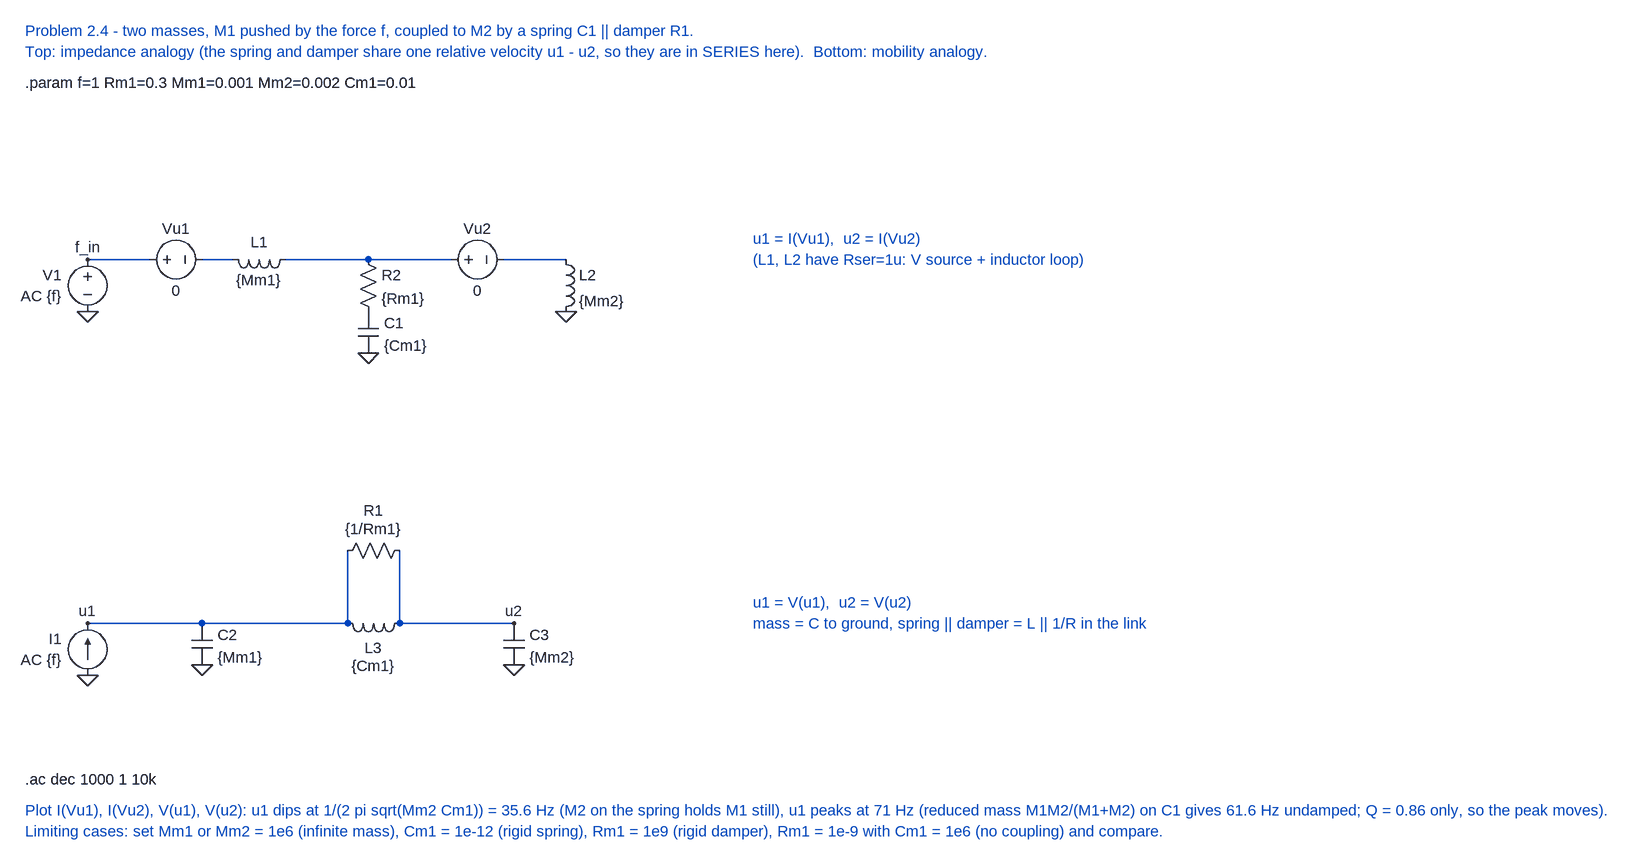
[diagram p0: schematic P2_4_Two_Mass.asc]
P2_4_Two_Mass.asc, the LTspice schematic file:
Version 4
SHEET 1 3000 1600
WIRE 0 0 96 0
WIRE 176 0 224 0
WIRE 304 0 560 0
WIRE 640 0 736 0
WIRE 0 560 400 560
WIRE 400 560 400 448
WIRE 480 560 480 448
WIRE 480 560 656 560
FLAG 0 80 0
FLAG 0 0 f_in
FLAG 432 144 0
FLAG 736 80 0
FLAG 0 640 0
FLAG 0 560 u1
FLAG 176 624 0
FLAG 656 560 u2
FLAG 656 624 0
SYMBOL voltage 0 -16 R0
WINDOW 0 -40 40 Right 2
WINDOW 3 -40 72 Right 2
SYMATTR InstName V1
SYMATTR Value AC {f}
SYMBOL voltage 80 0 R270
WINDOW 0 32 56 VTop 2
WINDOW 3 -32 56 VBottom 2
SYMATTR InstName Vu1
SYMATTR Value 0
SYMBOL ind 320 -16 R90
WINDOW 0 5 56 VBottom 2
WINDOW 3 32 56 VTop 2
SYMATTR InstName L1
SYMATTR Value {Mm1}
SYMATTR SpiceLine Rser=1u
SYMBOL res 416 -16 R0
SYMATTR InstName R2
SYMATTR Value {Rm1}
SYMBOL cap 416 80 R0
WINDOW 0 40 18 Left 2
WINDOW 3 40 52 Left 2
SYMATTR InstName C1
SYMATTR Value {Cm1}
SYMBOL voltage 544 0 R270
WINDOW 0 32 56 VTop 2
WINDOW 3 -32 56 VBottom 2
SYMATTR InstName Vu2
SYMATTR Value 0
SYMBOL ind 720 -16 R0
SYMATTR InstName L2
SYMATTR Value {Mm2}
SYMATTR SpiceLine Rser=1u
SYMBOL current 0 640 R180
WINDOW 0 40 56 Left 2
WINDOW 3 40 24 Left 2
SYMATTR InstName I1
SYMATTR Value AC {f}
SYMBOL cap 160 560 R0
WINDOW 0 40 18 Left 2
WINDOW 3 40 52 Left 2
SYMATTR InstName C2
SYMATTR Value {Mm1}
SYMBOL ind 496 544 R90
WINDOW 0 38 56 VTop 2
WINDOW 3 66 56 VTop 2
SYMATTR InstName L3
SYMATTR Value {Cm1}
SYMATTR SpiceLine Rser=1u
SYMBOL res 496 432 R90
WINDOW 0 -30 56 VBottom 2
WINDOW 3 -2 56 VBottom 2
SYMATTR InstName R1
SYMATTR Value {1/Rm1}
SYMBOL cap 640 560 R0
WINDOW 0 40 18 Left 2
WINDOW 3 40 52 Left 2
SYMATTR InstName C3
SYMATTR Value {Mm2}
TEXT -96 -352 Left 2 ;Problem 2.4 - two masses, M1 pushed by the force f, coupled to M2 by a spring C1 || damper R1.
TEXT -96 -320 Left 2 ;Top: impedance analogy (the spring and damper share one relative velocity u1 - u2, so they are in SERIES here).  Bottom: mobility analogy.
TEXT -96 -272 Left 2 !.param f=1 Rm1=0.3 Mm1=0.001 Mm2=0.002 Cm1=0.01
TEXT 1024 -32 Left 2 ;u1 = I(Vu1),  u2 = I(Vu2)
TEXT 1024 0 Left 2 ;(L1, L2 have Rser=1u: V source + inductor loop)
TEXT 1024 528 Left 2 ;u1 = V(u1),  u2 = V(u2)
TEXT 1024 560 Left 2 ;mass = C to ground, spring || damper = L || 1/R in the link
TEXT -96 800 Left 2 !.ac dec 1000 1 10k
TEXT -96 848 Left 2 ;Plot I(Vu1), I(Vu2), V(u1), V(u2): u1 dips at 1/(2 pi sqrt(Mm2 Cm1)) = 35.6 Hz (M2 on the spring holds M1 still), u1 peaks at 71 Hz (reduced mass M1M2/(M1+M2) on C1 gives 61.6 Hz undamped; Q = 0.86 only, so the peak moves).
TEXT -96 880 Left 2 ;Limiting cases: set Mm1 or Mm2 = 1e6 (infinite mass), Cm1 = 1e-12 (rigid spring), Rm1 = 1e9 (rigid damper), Rm1 = 1e-9 with Cm1 = 1e6 (no coupling) and compare.

The netlist it stands for:
* P2_4_Two_Mass.asc
V1 f_in 0 AC {f}
Vu1 f_in N001 0
L1 N002 N001 {Mm1} Rser=1u
R2 N002 P001 {Rm1}
C1 P001 0 {Cm1}
Vu2 N002 N003 0
L2 N003 0 {Mm2} Rser=1u
I1 0 u1 AC {f}
C2 u1 0 {Mm1}
L3 u2 u1 {Cm1} Rser=1u
R1 u2 u1 {1/Rm1}
C3 u2 0 {Mm2}
* Problem 2.4 - two masses, M1 pushed by the force f, coupled to M2 by a spring C1 || damper R1.
* Top: impedance analogy (the spring and damper share one relative velocity u1 - u2, so they are in SERIES here).  Bottom: mobility analogy.
.param f=1 Rm1=0.3 Mm1=0.001 Mm2=0.002 Cm1=0.01
* u1 = I(Vu1),  u2 = I(Vu2)
* (L1, L2 have Rser=1u: V source + inductor loop)
* u1 = V(u1),  u2 = V(u2)
* mass = C to ground, spring || damper = L || 1/R in the link
.ac dec 1000 1 10k
* Plot I(Vu1), I(Vu2), V(u1), V(u2): u1 dips at 1/(2 pi sqrt(Mm2 Cm1)) = 35.6 Hz (M2 on the spring holds M1 still), u1 peaks at 71 Hz (reduced mass M1M2/(M1+M2) on C1 gives 61.6 Hz undamped; Q = 0.86 only, so the peak moves).
* Limiting cases: set Mm1 or Mm2 = 1e6 (infinite mass), Cm1 = 1e-12 (rigid spring), Rm1 = 1e9 (rigid damper), Rm1 = 1e-9 with Cm1 = 1e6 (no coupling) and compare.
.backanno
.end